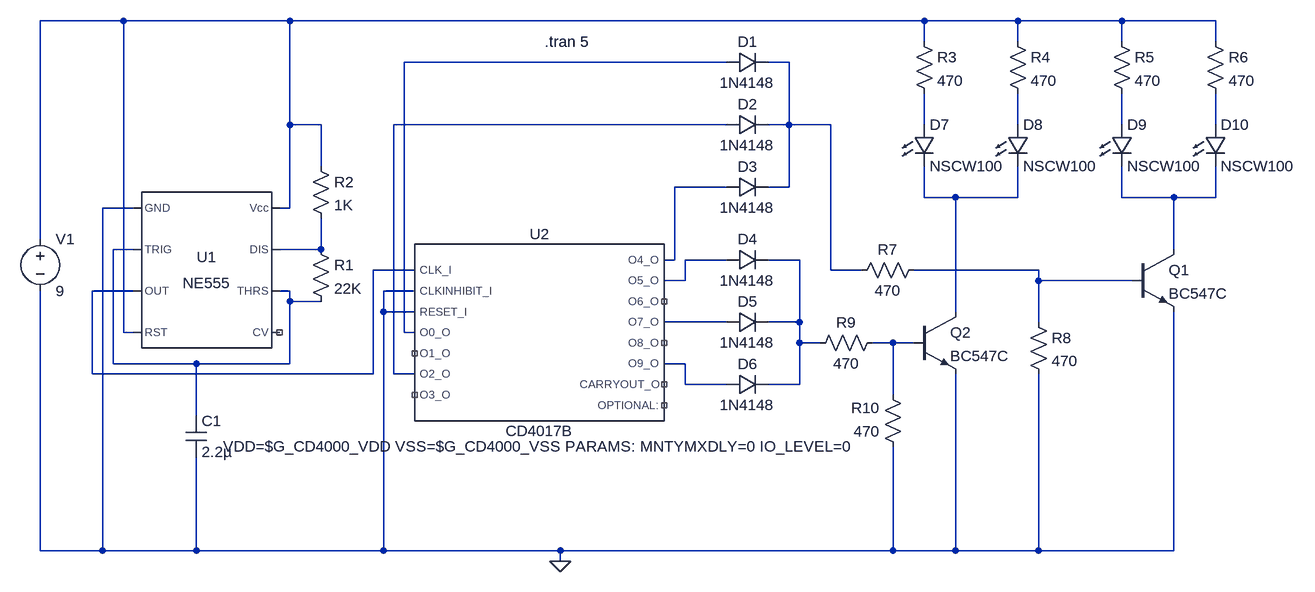
[diagram p0: schematic police light.asc]
police light.asc, the LTspice schematic file:
Version 4
SHEET 1 1604 708
WIRE -432 -384 -560 -384
WIRE -176 -384 -432 -384
WIRE 800 -384 -176 -384
WIRE 944 -384 800 -384
WIRE 1104 -384 944 -384
WIRE 1248 -384 1104 -384
WIRE 800 -352 800 -384
WIRE 944 -352 944 -384
WIRE 1104 -352 1104 -384
WIRE 1248 -352 1248 -384
WIRE 496 -320 0 -320
WIRE 592 -320 560 -320
WIRE -176 -224 -176 -384
WIRE -128 -224 -176 -224
WIRE 496 -224 -16 -224
WIRE 592 -224 592 -320
WIRE 592 -224 560 -224
WIRE 656 -224 592 -224
WIRE 800 -224 800 -272
WIRE 944 -224 944 -272
WIRE 1104 -224 1104 -272
WIRE 1248 -224 1248 -272
WIRE -128 -160 -128 -224
WIRE 496 -128 416 -128
WIRE 592 -128 592 -224
WIRE 592 -128 560 -128
WIRE 800 -112 800 -160
WIRE 848 -112 800 -112
WIRE 944 -112 944 -160
WIRE 944 -112 848 -112
WIRE 1104 -112 1104 -160
WIRE 1184 -112 1104 -112
WIRE 1248 -112 1248 -160
WIRE 1248 -112 1184 -112
WIRE -416 -96 -464 -96
WIRE -176 -96 -176 -224
WIRE -176 -96 -192 -96
WIRE -560 -48 -560 -384
WIRE -416 -32 -448 -32
WIRE -128 -32 -128 -80
WIRE -128 -32 -192 -32
WIRE 1184 -32 1184 -112
WIRE 416 -16 416 -128
WIRE 416 -16 400 -16
WIRE 496 -16 432 -16
WIRE 608 -16 560 -16
WIRE 16 0 -48 0
WIRE 656 0 656 -224
WIRE 704 0 656 0
WIRE 976 0 784 0
WIRE 432 16 432 -16
WIRE 432 16 400 16
WIRE 976 16 976 0
WIRE 1120 16 976 16
WIRE -416 32 -480 32
WIRE -176 32 -192 32
WIRE 16 32 -32 32
WIRE -176 48 -176 32
WIRE -128 48 -176 48
WIRE -32 64 -32 32
WIRE 16 64 -32 64
WIRE 848 64 848 -112
WIRE 496 80 400 80
WIRE 608 80 608 -16
WIRE 608 80 560 80
WIRE 976 80 976 16
WIRE -432 96 -432 -384
WIRE -416 96 -432 96
WIRE 0 96 0 -320
WIRE 16 96 0 96
WIRE 608 112 608 80
WIRE 640 112 608 112
WIRE 752 112 720 112
WIRE 784 112 752 112
WIRE -448 144 -448 -32
WIRE -320 144 -448 144
WIRE -176 144 -176 48
WIRE -176 144 -320 144
WIRE 432 144 400 144
WIRE -480 160 -480 32
WIRE -48 160 -48 0
WIRE -48 160 -480 160
WIRE -16 160 -16 -224
WIRE 16 160 -16 160
WIRE 432 176 432 144
WIRE 496 176 432 176
WIRE 608 176 608 112
WIRE 608 176 560 176
WIRE 752 192 752 112
WIRE -320 224 -320 144
WIRE -560 432 -560 32
WIRE -464 432 -464 -96
WIRE -464 432 -560 432
WIRE -320 432 -320 288
WIRE -320 432 -464 432
WIRE -32 432 -32 64
WIRE -32 432 -320 432
WIRE 240 432 -32 432
WIRE 752 432 752 272
WIRE 752 432 240 432
WIRE 848 432 848 160
WIRE 848 432 752 432
WIRE 976 432 976 160
WIRE 976 432 848 432
WIRE 1184 432 1184 64
WIRE 1184 432 976 432
WIRE 240 448 240 432
FLAG 240 448 0
SYMBOL npn2 1120 -32 R0
SYMATTR InstName Q1
SYMATTR Value BC547C
SYMBOL npn2 784 64 R0
SYMATTR InstName Q2
SYMATTR Value BC547C
SYMBOL res -144 -48 R0
SYMATTR InstName R1
SYMATTR Value 22K
SYMBOL res -144 -176 R0
SYMATTR InstName R2
SYMATTR Value 1K
SYMBOL res 784 -368 R0
SYMATTR InstName R3
SYMATTR Value 470
SYMBOL res 928 -368 R0
SYMATTR InstName R4
SYMATTR Value 470
SYMBOL res 1088 -368 R0
SYMATTR InstName R5
SYMATTR Value 470
SYMBOL res 1232 -368 R0
SYMATTR InstName R6
SYMATTR Value 470
SYMBOL res 688 16 R270
WINDOW 0 32 56 VTop 2
WINDOW 3 0 56 VBottom 2
SYMATTR InstName R7
SYMATTR Value 470
SYMBOL res 960 64 R0
SYMATTR InstName R8
SYMATTR Value 470
SYMBOL res 736 96 R90
WINDOW 0 0 56 VBottom 2
WINDOW 3 32 56 VTop 2
SYMATTR InstName R9
SYMATTR Value 470
SYMBOL res 768 288 R180
WINDOW 0 36 76 Left 2
WINDOW 3 36 40 Left 2
SYMATTR InstName R10
SYMATTR Value 470
SYMBOL Misc\\NE555 -304 0 R0
SYMATTR InstName U1
SYMBOL voltage -560 -64 R0
WINDOW 123 0 0 Left 2
WINDOW 39 0 0 Left 2
SYMATTR InstName V1
SYMATTR Value 9
SYMBOL LED 784 -224 R0
SYMATTR InstName D7
SYMATTR Value NSCW100
SYMBOL LED 928 -224 R0
SYMATTR InstName D8
SYMATTR Value NSCW100
SYMBOL LED 1088 -224 R0
SYMATTR InstName D9
SYMATTR Value NSCW100
SYMBOL LED 1232 -224 R0
SYMATTR InstName D10
SYMATTR Value NSCW100
SYMBOL diode 496 -336 M90
WINDOW 0 0 32 VBottom 2
WINDOW 3 32 32 VTop 2
SYMATTR InstName D1
SYMATTR Value 1N4148
SYMBOL diode 496 -240 M90
WINDOW 0 0 32 VBottom 2
WINDOW 3 32 32 VTop 2
SYMATTR InstName D2
SYMATTR Value 1N4148
SYMBOL diode 496 -144 M90
WINDOW 0 0 32 VBottom 2
WINDOW 3 32 32 VTop 2
SYMATTR InstName D3
SYMATTR Value 1N4148
SYMBOL diode 496 -32 M90
WINDOW 0 0 32 VBottom 2
WINDOW 3 32 32 VTop 2
SYMATTR InstName D4
SYMATTR Value 1N4148
SYMBOL diode 496 64 M90
WINDOW 0 0 32 VBottom 2
WINDOW 3 32 32 VTop 2
SYMATTR InstName D5
SYMATTR Value 1N4148
SYMBOL diode 496 160 M90
WINDOW 0 0 32 VBottom 2
WINDOW 3 32 32 VTop 2
SYMATTR InstName D6
SYMATTR Value 1N4148
SYMBOL cap -336 224 R0
SYMATTR InstName C1
SYMATTR Value 2.2µ
SYMBOL CD4017B 208 96 R0
SYMATTR InstName U2
TEXT 216 -352 Left 2 !.tran 5

The netlist it stands for:
* police light.asc
Q1 N011 N017 0 0 BC547C
Q2 N010 N019 0 0 BC547C
R1 N013 N012 22K
R2 N001 N013 1K
R3 N001 N005 470
R4 N001 N006 470
R5 N001 N007 470
R6 N001 N008 470
R7 N003 N017 470
R8 N017 0 470
R9 N019 N015 470
R10 0 N019 470
XU1 0 N012 N016 N001 NC_01 N012 N013 N001 NE555  ; pins GND TRIG OUT RST CV THRS DIS Vcc
V1 N001 0 9
D7 N005 N010 NSCW100
D8 N006 N010 NSCW100
D9 N007 N011 NSCW100
D10 N008 N011 NSCW100
D1 N002 N003 1N4148
D2 N004 N003 1N4148
D3 N009 N003 1N4148
D4 N014 N015 1N4148
D5 N018 N015 1N4148
D6 N020 N015 1N4148
C1 N012 0 2.2µ
XU2 N016 0 0 N002 NC_02 N004 NC_03 N009 N014 NC_04 N018 NC_05 N020 NC_06 NC_07 CD4017B VDD=$G_CD4000_VDD VSS=$G_CD4000_VSS PARAMS: MNTYMXDLY=0 IO_LEVEL=0  ; pins CLK_I CLKINHIBIT_I RESET_I O0_O O1_O O2_O O3_O O4_O O5_O O6_O O7_O O8_O O9_O CARRYOUT_O OPTIONAL:
.model D D
.lib standard.dio
.model NPN NPN
.model PNP PNP
.lib standard.bjt
.tran 5
.lib NE555.sub
.lib C:\Users\Reiner\Desktop\EE 221L Final Project\CD4017B.mod
.backanno
.end